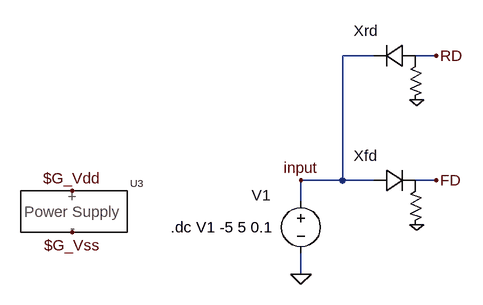
[diagram p0: schematic diode_test.asc]
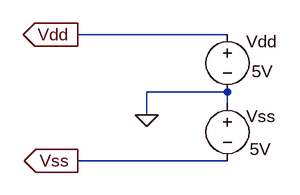
[diagram p1: sub-circuit tpower.asc]
diode_test.asc, the LTspice schematic file:
Version 4
SHEET 1 880 680
WIRE 192 -16 144 -16
WIRE 288 -16 256 -16
WIRE 144 176 144 -16
WIRE 144 176 80 176
WIRE 192 176 144 176
WIRE 288 176 256 176
WIRE 80 208 80 176
WIRE 80 320 80 288
FLAG 80 320 0
FLAG -272 256 $G_Vss
FLAG -272 192 $G_Vdd
FLAG 80 176 input
FLAG 288 -16 RD
FLAG 288 176 FD
SYMBOL voltage 80 192 R0
WINDOW 3 24 104 Invisible 0
WINDOW 0 -76 7 Left 0
SYMATTR Value -5V
SYMATTR InstName V1
SYMBOL tpower -272 224 R0
SYMATTR InstName U3
SYMBOL fd 208 160 R0
SYMATTR InstName Xfd
SYMBOL rd 208 -32 R0
SYMATTR InstName Xrd
TEXT -120 248 Left 0 !.dc V1 -5 5 0.1

tpower.asc, the sub-circuit schematic file:
Version 4
SHEET 1 880 680
WIRE -112 32 -320 32
WIRE -112 112 -224 112
WIRE -112 128 -112 112
WIRE -224 144 -224 112
WIRE -112 208 -320 208
FLAG -224 144 0
FLAG -320 32 Vdd
IOPIN -320 32 Out
FLAG -320 208 Vss
IOPIN -320 208 Out
SYMBOL voltage -112 16 R0
WINDOW 0 26 26 Left 0
WINDOW 3 34 68 Left 0
SYMATTR InstName Vdd
SYMATTR Value 5V
SYMBOL voltage -112 112 R0
WINDOW 0 26 34 Left 0
WINDOW 3 31 80 Left 0
SYMATTR InstName Vss
SYMATTR Value 5V

The netlist it stands for:
* diode_test.asc
V1 input 0 -5V
XU3 $G_Vdd $G_Vss tpower
XXfd input FD fd  ; pins IN OUT
XXrd input RD rd  ; pins IN OUT

* block symbol definitions
.subckt tpower Vdd Vss
Vdd Vdd 0 5V
Vss 0 Vss 5V
.ends tpower

.dc V1 -5 5 0.1
.backanno
.end